# EAGLE design LSM9DS0 (EAGLE 7.1.0)
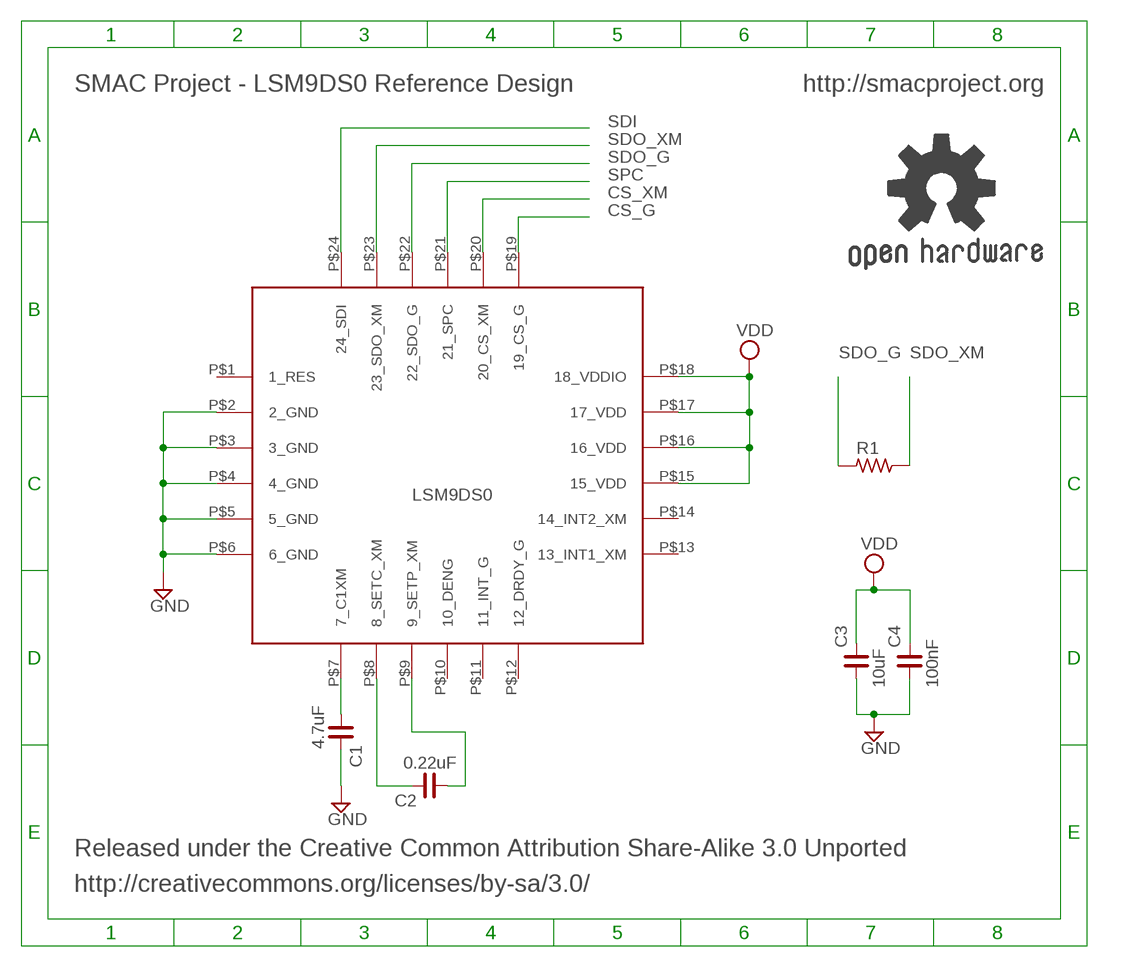
[diagram p0: schematic, sheet 1]

## Parts
C1  4.7uF  C_0402  [C0402]
C2  0.22uF  C_0402  [C0402]
C3  10uF  C_0402  [C0402]
C4  100nF  C_0402  [C0402]
GOLD_ORB_SM2  OSHWLOGO_REF_SM  [OSHW2REF]
R1  R_0402  [R0402]
U$1  LSM9DS09DOFS0  [LGA24(4X4X1)]

## Nets
CS_G: U$1.P$19(19_CS_G)
CS_XM: U$1.P$20(20_CS_XM)
GND: C1.2 C3.1 C4.1 U$1.P$2(2_GND) U$1.P$3(3_GND) U$1.P$4(4_GND) U$1.P$5(5_GND) U$1.P$6(6_GND)
N$1: C1.1 U$1.P$7(7_C1XM)
N$2: C2.2 U$1.P$8(8_SETC_XM)
N$3: C2.1 U$1.P$9(9_SETP_XM)
SDI: U$1.P$24(24_SDI)
SDO_G: R1.1 U$1.P$22(22_SDO_G)
SDO_XM: R1.2 U$1.P$23(23_SDO_XM)
SPC: U$1.P$21(21_SPC)
VDD: C3.2 C4.2 U$1.P$15(15_VDD) U$1.P$16(16_VDD) U$1.P$17(17_VDD) U$1.P$18(18_VDDIO)
Unconnected: U$1.P$1(1_RES) U$1.P$10(10_DENG) U$1.P$11(11_INT_G) U$1.P$12(12_DRDY_G) U$1.P$13(13_INT1_XM) U$1.P$14(14_INT2_XM)

## Notes on the sheet
- SMAC Project - LSM9DS0 Reference Design | http://smacproject.org
- Released under the Creative Common Attribution Share-Alike 3.0 Unported
- http://creativecommons.org/licenses/by-sa/3.0/

## Library data of the parts
C1-C4 = rc-master-smd:C_: NON-POLARIZED CAP
GOLD_ORB_SM2 = bfl:OSHWLOGO: These are Open-Source Hardware logos.
R1 = rc-master-smd:R_: RESISTOR
U$1 = lsm9ds0:LSM9DS0

## Board
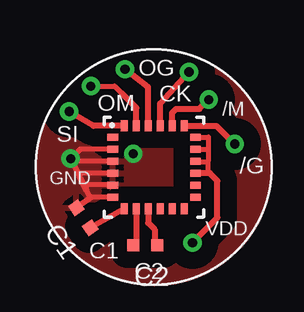
[diagram p1: board, top side]
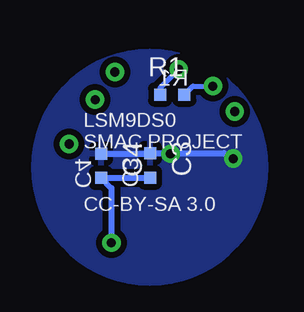
[diagram p2: board, bottom side, seen from below]

No outline drawn. Coordinates in mm, seen from the top.
Copper layers (1*16): Top 0.035mm / dielectric 0.1mm / Bottom 0.035mm
Design rules "standard_4pcb": minimum track width 0.1mm, minimum drill 0.1mm, track to track 0.16mm, track to pad 0.16mm, pad to pad 0.15mm, via to via 0.15mm, smd to smd 0mil, copper to edge 0.1mm, drill to drill 0.1mm, minimum pad ring 0.13mm, minimum via ring 0.13mm, stop-mask expansion 0.015mm, vias tented up to drill 15mil, thermal gap 10mil

### Footprints (pad centres in the part's own frame; a part is rotated, then mirrored left to right if it is on the bottom)
C0402 = smd 0.5 x 0.5: 1 -0.508,0; 2 0.508,0
R0402 = smd 0.5 x 0.5: 1 -0.508,0; 2 0.508,0
LGA24(4X4X1) = smd 0.45 x 0.3: P$1 -1.725,1.25; P$2 -1.725,0.75; P$3 -1.725,0.25; P$4 -1.725,-0.25; P$5 -1.725,-0.75; P$6 -1.725,-1.25; P$13 1.725,-1.25; P$14 1.725,-0.75; P$15 1.725,-0.25; P$16 1.725,0.25; P$17 1.725,0.75; P$18 1.725,1.25 | smd 0.3 x 0.45: P$7 -1.25,-1.725; P$8 -0.75,-1.725; P$9 -0.25,-1.725; P$10 0.25,-1.725; P$11 0.75,-1.725; P$12 1.25,-1.725; P$19 1.25,1.725; P$20 0.75,1.725; P$21 0.25,1.725; P$22 -0.25,1.725; P$23 -0.75,1.725; P$24 -1.25,1.725

### Placement (x,y rotation side)
C1  -2.95,-2.11 125 top
C2  -0.37,-3.25 180 top
C3  -0.02,0.08 270 bottom
C4  2.03,0.06 270 bottom
GOLD_ORB_SM1  OSHWLOGO_REF_SM  [OSHW2REF]  6.65,-3.47 0 top
GOLD_ORB_SM2  -4.43,-10.95 0 top
R1  -0.94,3.03 0 bottom
U$1  0,0 0 top

### Tracks (layer width: path | path; a pad name or v marks a point on that pad's centre or on a via)
CS_G  (via drill 0.38 pad 0.76)
  Top 0.254: U$1.P$19 2.6,1.73 v3.36,0.96
CS_XM  (via drill 0.38 pad 0.76)
  Top 0.254: U$1.P$20 0.75,2.26 0.92,2.43 1.89,2.43 v2.27,2.82
GND  (via drill 0.38 pad 0.76)
  Top 0.2: U$1.P$6 -2.66,-1.25 -2.66,-1.29 | U$1.P$5 -1.74,-0.73 -2.29,-0.73 -2.83,-0.73 -2.83,-0.95 | U$1.P$4 -3.11,-0.25 -3.11,-0.39 | U$1.P$3 -3.48,0.25 v-3.48,0.36 -3.09,0.75 U$1.P$2
  Top 0.254: C1.2 -2.66,-1.29 -2.83,-0.95 -3.11,-0.39 v-3.48,0.36 | U$1.P$2
  Bottom 0.254: C4.1 0,0.57 C3.1 -3.09,0.59 v-3.48,0.36
  other vias: -0.87,0.56
  pour Bottom (isolate 0.25): 0,4.9 arc-90 4.9,0 arc-90 0,-4.9 arc-90 -4.9,0 arc-90
  pour Top (isolate 0.7): 0.01,4.89 arc-90 4.91,-0.01 arc-90 0.01,-4.91 arc-90 -4.89,-0.01 arc-90
N$1
  Top 0.254: U$1.P$7 C1.1
N$2
  Top 0.254: C2.2 -0.75,-3.25 U$1.P$8
N$3
  Top 0.254: C2.1 0.02,-3.25 0.02,-2.59 -0.25,-2.32 U$1.P$9
SDI  (via drill 0.38 pad 0.76)
  Top 0.254: v-3.54,2.32 -2.53,1.73 U$1.P$24
SDO_G  (via drill 0.38 pad 0.76)
  Top 0.254: U$1.P$22 -0.25,3.33 v-1.21,4.09
  Bottom 0.2: R1.1 -0.43,3.31 v-1.21,4.09
SDO_XM  (via drill 0.38 pad 0.76)
  Top 0.2: v-2.63,3.38 -1.65,3.38 -1.36,3.09
  Top 0.254: U$1.P$23 -0.74,2.47 -1.36,3.09
  Bottom 0.2: R1.2 -1.8,3.38 v-2.63,3.38
SPC  (via drill 0.38 pad 0.76)
  Top 0.254: U$1.P$21 0.25,2.66 v1.45,3.97
VDD  (via drill 0.38 pad 0.76)
  Top 0.2: 2.26,-0.24 2.25,-0.25 U$1.P$15 2.26,-0.25 2.26,0.28 | U$1.P$16 arc90 1.75,0.23 2.2,0.23 arc90 2.26,0.28 | U$1.P$18 2.26,1.25 2.26,0.76 | 2.26,0.76 2.26,0.28 | U$1.P$17 2.26,0.75 2.26,0.76
  Top 0.254: U$1.P$15 2.32,-0.25 2.64,-0.57 2.64,-2.11 v1.6,-3.15
  Bottom 0.254: C3.2 2.01,-0.43 C4.2 1.6,-0.88 v1.6,-3.15

### Text on the board
tPlace: OG | CK | OM | /M | SI | /G | GND | VDD | C1 | C2
bPlace: R1 | LSM9DS0 | SMAC PROJECT | C3 | C4 | CC-BY-SA 3.0
Reference: http://smacproject.org